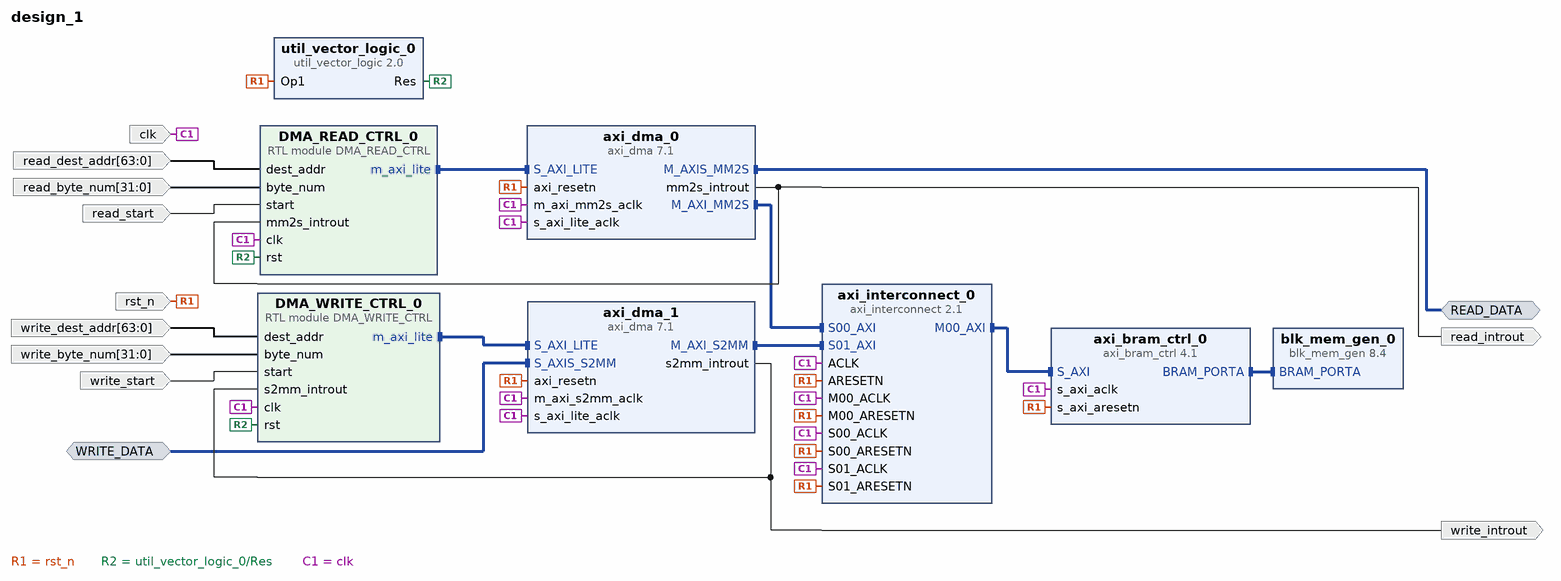
[diagram p0: block diagram of the top level]
# Vivado block design design_1, xc7k325tffg900-1, Vivado 2020.2
create_bd_design design_1

create_bd_intf_port -mode Slave -vlnv xilinx.com:interface:axis_rtl:1.0 WRITE_DATA
set_property -dict [list \
  CONFIG.HAS_TKEEP 1 \
  CONFIG.HAS_TLAST 1 \
  CONFIG.HAS_TREADY 1 \
  CONFIG.HAS_TSTRB 0 \
  CONFIG.LAYERED_METADATA undef \
  CONFIG.TDATA_NUM_BYTES 1 \
  CONFIG.TDEST_WIDTH 0 \
  CONFIG.TID_WIDTH 0 \
  CONFIG.TUSER_WIDTH 0 \
] [get_bd_intf_ports WRITE_DATA]
create_bd_intf_port -mode Master -vlnv xilinx.com:interface:axis_rtl:1.0 READ_DATA
create_bd_port -dir I -type rst rst_n
set_property -dict {CONFIG.POLARITY ACTIVE_LOW} [get_bd_ports rst_n]
create_bd_port -dir I -type clk clk
create_bd_port -dir O -type intr read_introut
create_bd_port -dir O -type intr write_introut
create_bd_port -dir I -from 63 -to 0 read_dest_addr
create_bd_port -dir I -from 31 -to 0 read_byte_num
create_bd_port -dir I read_start
create_bd_port -dir I -from 63 -to 0 write_dest_addr
create_bd_port -dir I -from 31 -to 0 write_byte_num
create_bd_port -dir I write_start

create_bd_cell -type ip -vlnv xilinx.com:ip:axi_dma:7.1 axi_dma_0
set_property -dict [list \
  CONFIG.c_include_s2mm 0 \
  CONFIG.c_include_sg 0 \
  CONFIG.c_m_axi_mm2s_data_width 64 \
  CONFIG.c_m_axis_mm2s_tdata_width 8 \
  CONFIG.c_mm2s_burst_size 8 \
  CONFIG.c_sg_length_width 26 \
] [get_bd_cells axi_dma_0]
create_bd_cell -type ip -vlnv xilinx.com:ip:axi_dma:7.1 axi_dma_1
set_property -dict [list \
  CONFIG.c_include_mm2s 0 \
  CONFIG.c_include_s2mm 1 \
  CONFIG.c_include_sg 0 \
  CONFIG.c_m_axi_s2mm_data_width 64 \
  CONFIG.c_s2mm_burst_size 8 \
  CONFIG.c_s_axis_s2mm_tdata_width 8 \
  CONFIG.c_sg_length_width 26 \
] [get_bd_cells axi_dma_1]
create_bd_cell -type ip -vlnv xilinx.com:ip:axi_bram_ctrl:4.1 axi_bram_ctrl_0
set_property -dict {CONFIG.DATA_WIDTH 64 CONFIG.SINGLE_PORT_BRAM 1} [get_bd_cells axi_bram_ctrl_0]
create_bd_cell -type ip -vlnv xilinx.com:ip:axi_interconnect:2.1 axi_interconnect_0
set_property -dict [list \
  CONFIG.M00_HAS_DATA_FIFO 1 \
  CONFIG.M00_HAS_REGSLICE 3 \
  CONFIG.NUM_MI 1 \
  CONFIG.NUM_SI 2 \
  CONFIG.S00_HAS_DATA_FIFO 1 \
  CONFIG.S00_HAS_REGSLICE 3 \
  CONFIG.S01_HAS_DATA_FIFO 1 \
  CONFIG.S01_HAS_REGSLICE 3 \
] [get_bd_cells axi_interconnect_0]
create_bd_cell -type ip -vlnv xilinx.com:ip:util_vector_logic:2.0 util_vector_logic_0
set_property -dict {CONFIG.C_OPERATION not CONFIG.C_SIZE 1} [get_bd_cells util_vector_logic_0]
create_bd_cell -type module -reference DMA_WRITE_CTRL DMA_WRITE_CTRL_0
create_bd_cell -type module -reference DMA_READ_CTRL DMA_READ_CTRL_0
create_bd_cell -type ip -vlnv xilinx.com:ip:blk_mem_gen:8.4 blk_mem_gen_0
set_property -dict {CONFIG.EN_SAFETY_CKT false} [get_bd_cells blk_mem_gen_0]

# ---- connections ----

connect_bd_intf_net [get_bd_intf_pins blk_mem_gen_0/BRAM_PORTA] [get_bd_intf_pins axi_bram_ctrl_0/BRAM_PORTA]
connect_bd_intf_net [get_bd_intf_ports READ_DATA] [get_bd_intf_pins axi_dma_0/M_AXIS_MM2S]
connect_bd_intf_net [get_bd_intf_pins axi_dma_0/M_AXI_MM2S] [get_bd_intf_pins axi_interconnect_0/S00_AXI]
connect_bd_intf_net [get_bd_intf_pins DMA_WRITE_CTRL_0/m_axi_lite] [get_bd_intf_pins axi_dma_1/S_AXI_LITE]
connect_bd_intf_net [get_bd_intf_pins axi_interconnect_0/M00_AXI] [get_bd_intf_pins axi_bram_ctrl_0/S_AXI]
connect_bd_intf_net [get_bd_intf_pins axi_dma_1/M_AXI_S2MM] [get_bd_intf_pins axi_interconnect_0/S01_AXI]
connect_bd_intf_net [get_bd_intf_pins DMA_READ_CTRL_0/m_axi_lite] [get_bd_intf_pins axi_dma_0/S_AXI_LITE]
connect_bd_intf_net -intf_net S_AXIS_S2MM_0_1 [get_bd_intf_ports WRITE_DATA] [get_bd_intf_pins axi_dma_1/S_AXIS_S2MM]
connect_bd_net [get_bd_ports rst_n] \
  [get_bd_pins util_vector_logic_0/Op1] [get_bd_pins axi_dma_0/axi_resetn] [get_bd_pins axi_dma_1/axi_resetn] \
  [get_bd_pins axi_interconnect_0/ARESETN] [get_bd_pins axi_interconnect_0/S00_ARESETN] \
  [get_bd_pins axi_interconnect_0/M00_ARESETN] [get_bd_pins axi_interconnect_0/S01_ARESETN] \
  [get_bd_pins axi_bram_ctrl_0/s_axi_aresetn]
connect_bd_net [get_bd_pins util_vector_logic_0/Res] [get_bd_pins DMA_WRITE_CTRL_0/rst] [get_bd_pins DMA_READ_CTRL_0/rst]
connect_bd_net -net clk_0_1 [get_bd_ports clk] \
  [get_bd_pins axi_dma_0/s_axi_lite_aclk] [get_bd_pins axi_dma_0/m_axi_mm2s_aclk] [get_bd_pins axi_dma_1/s_axi_lite_aclk] \
  [get_bd_pins axi_dma_1/m_axi_s2mm_aclk] [get_bd_pins axi_interconnect_0/ACLK] [get_bd_pins axi_interconnect_0/S00_ACLK] \
  [get_bd_pins axi_interconnect_0/M00_ACLK] [get_bd_pins axi_interconnect_0/S01_ACLK] \
  [get_bd_pins axi_bram_ctrl_0/s_axi_aclk] [get_bd_pins DMA_WRITE_CTRL_0/clk] [get_bd_pins DMA_READ_CTRL_0/clk]
connect_bd_net [get_bd_pins axi_dma_0/mm2s_introut] [get_bd_ports read_introut] [get_bd_pins DMA_READ_CTRL_0/mm2s_introut]
connect_bd_net [get_bd_pins axi_dma_1/s2mm_introut] [get_bd_ports write_introut] [get_bd_pins DMA_WRITE_CTRL_0/s2mm_introut]
connect_bd_net -net dest_addr_0_1 [get_bd_ports read_dest_addr] [get_bd_pins DMA_READ_CTRL_0/dest_addr]
connect_bd_net -net byte_num_0_1 [get_bd_ports read_byte_num] [get_bd_pins DMA_READ_CTRL_0/byte_num]
connect_bd_net -net start_0_1 [get_bd_ports read_start] [get_bd_pins DMA_READ_CTRL_0/start]
connect_bd_net -net dest_addr_0_2 [get_bd_ports write_dest_addr] [get_bd_pins DMA_WRITE_CTRL_0/dest_addr]
connect_bd_net -net byte_num_0_2 [get_bd_ports write_byte_num] [get_bd_pins DMA_WRITE_CTRL_0/byte_num]
connect_bd_net -net start_0_2 [get_bd_ports write_start] [get_bd_pins DMA_WRITE_CTRL_0/start]

# ---- address map ----
assign_bd_address -offset 0xC0000000 -range 4K -target_address_space [get_bd_addr_spaces axi_dma_0/Data_MM2S] [get_bd_addr_segs axi_bram_ctrl_0/S_AXI/Mem0]
assign_bd_address -offset 0xC0000000 -range 4K -target_address_space [get_bd_addr_spaces axi_dma_1/Data_S2MM] [get_bd_addr_segs axi_bram_ctrl_0/S_AXI/Mem0]
assign_bd_address -offset 0x0000 -range 4K -target_address_space [get_bd_addr_spaces DMA_READ_CTRL_0/m_axi_lite] [get_bd_addr_segs axi_dma_0/S_AXI_LITE/Reg]
assign_bd_address -offset 0x0000 -range 4K -target_address_space [get_bd_addr_spaces DMA_WRITE_CTRL_0/m_axi_lite] [get_bd_addr_segs axi_dma_1/S_AXI_LITE/Reg]

validate_bd_design
save_bd_design
